# Altium schematic sheet 2_POWER.schdoc
size 309 x 223 mm; Symbol: Sheet-Symbol_A4; Device: Sheet-Symbol_A4; Company: 嘉立创EDA; Version: V1.0; Page Size: A4; @Project Name: STM32F407保险方案; @Page Count: 2; @Update Date: 2024-10-12; @Create Date: 2024-10-12; @Schematic Name: Schematic1_2; @Page No: 2; @Page Name: POWER; @Board Name: Board1_v1_修改; @Create Time: 12:06:10; @Update Time: 15:22:18
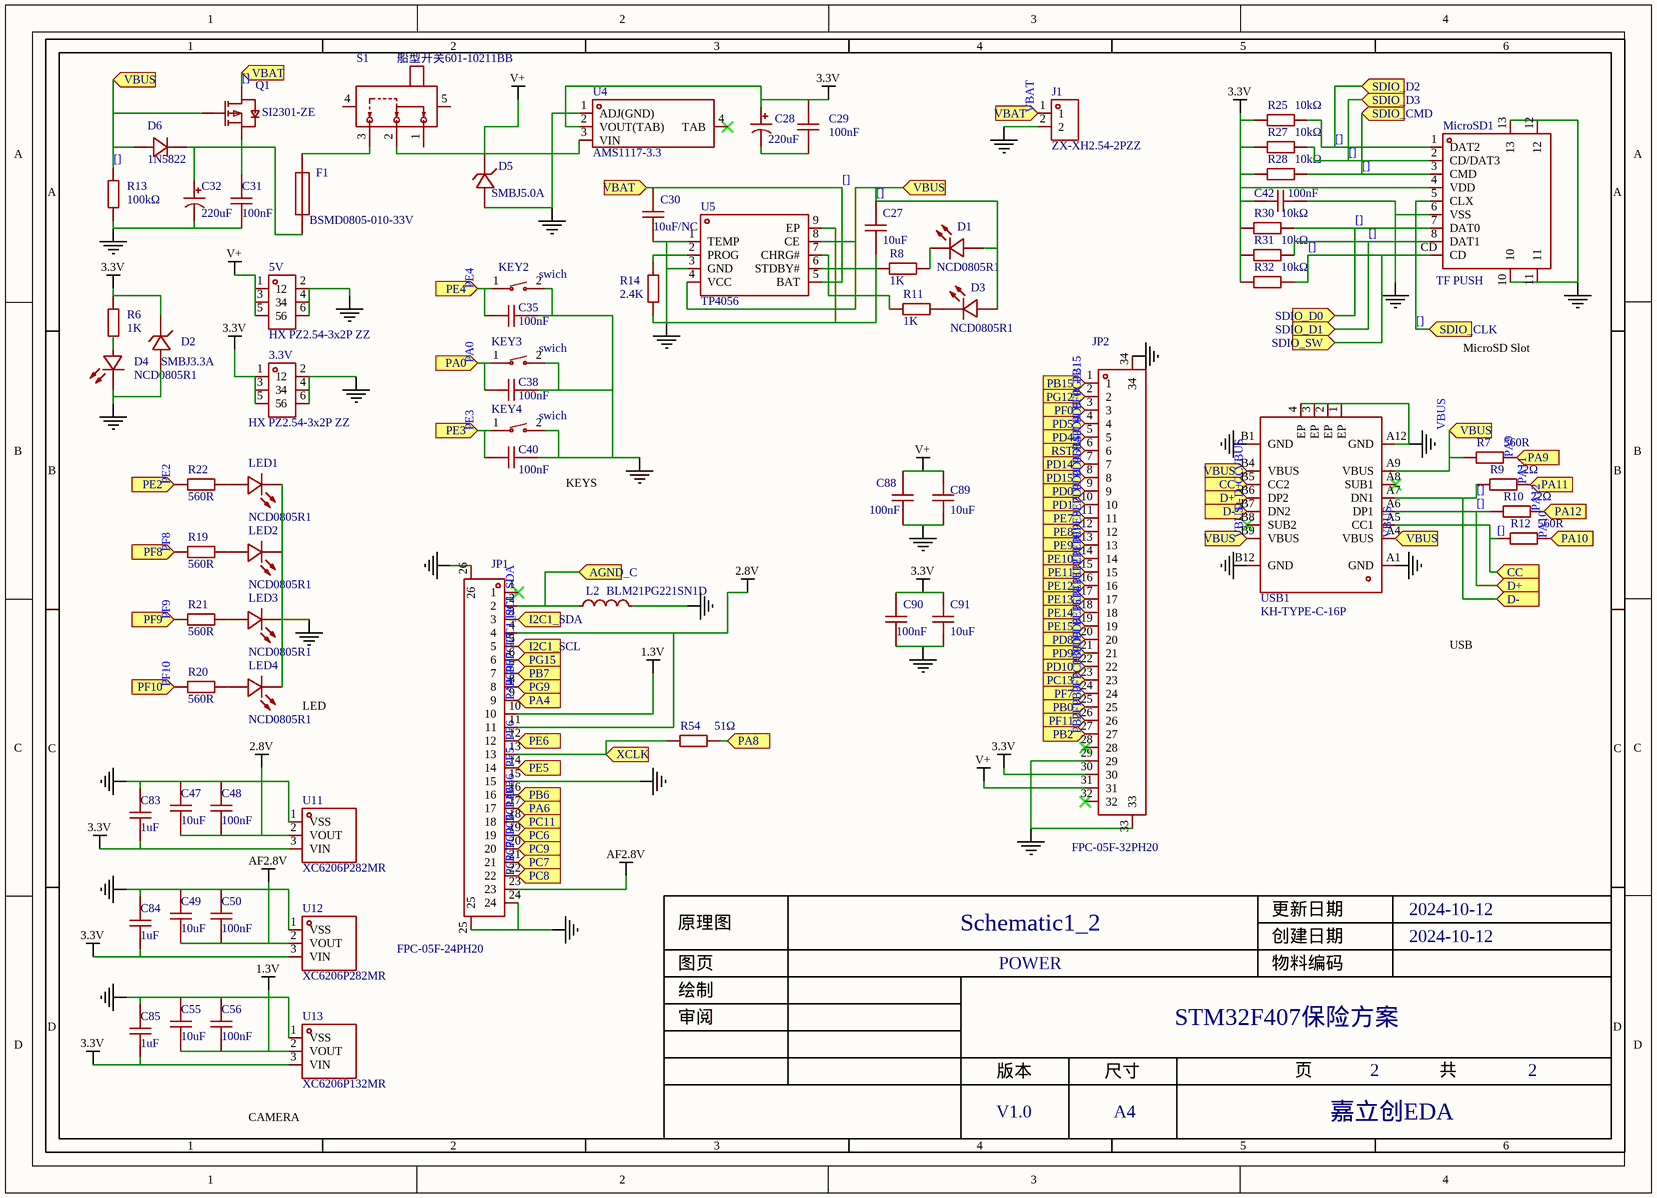
[diagram p0: 2_POWER.schdoc]

## Parts
3.3V  HX PZ2.54-3x2P ZZ  [HDR-TH_6P-P2.54-V-M-R3-C2-S2.54_2]  (value not drawn)
5V  HX PZ2.54-3x2P ZZ  [HDR-TH_6P-P2.54-V-M-R3-C2-S2.54_2]  (value not drawn)
C27  10uF  [C0805]  (value not drawn)
C28  220uF  [CAP-TH_BD8.0-P3.50-D0.6-FD]  (value not drawn)
C29  100nF  [C0805]  (value not drawn)
C30  10uF/NC  [C0805]  (value not drawn)
C31  100nF  [C0805]  (value not drawn)
C32  220uF  [CAP-TH_BD8.0-P3.50-D0.6-FD]  (value not drawn)
C35  100nF  [C0805]  (value not drawn)
C38  100nF  [C0805]  (value not drawn)
C40  100nF  [C0805]  (value not drawn)
C42  100nF  [C0805]  (value not drawn)
C47  10uF  [C0805]  (value not drawn)
C48  100nF  [C0805]  (value not drawn)
C49  10uF  [C0805]  (value not drawn)
C50  100nF  [C0805]  (value not drawn)
C55  10uF  [C0805]  (value not drawn)
C56  100nF  [C0805]  (value not drawn)
C83  1uF  [C0805]  (value not drawn)
C84  1uF  [C0805]  (value not drawn)
C85  1uF  [C0805]  (value not drawn)
C88  100nF  [C0805]  (value not drawn)
C89  10uF  [C0805]  (value not drawn)
C90  100nF  [C0805]  (value not drawn)
C91  10uF  [C0805]  (value not drawn)
D1  NCD0805R1  [LED0805-R-RD]  (value not drawn)
D2  SMBJ3.3A  [SMB_L4.6-W3.6-LS5.3-RD]  (value not drawn)
D3  NCD0805R1  [LED0805-R-RD]  (value not drawn)
D4  NCD0805R1  [LED0805-R-RD]  (value not drawn)
D5  SMBJ5.0A  [SMB_L4.4-W3.6-LS5.3-RD]  (value not drawn)
D6  1N5822  [SMA_1N4007]  (value not drawn)
F1  BSMD0805-010-33V  [F0805]  (value not drawn)
J1  ZX-XH2.54-2PZZ  [CONN-TH_2P-P2.50_HX25003-2A]  (value not drawn)
JP1  FPC-05F-24PH20  [FPC-SMD_24P-P0.50_FPC-05F-24PH20]  (value not drawn)
JP2  FPC-05F-32PH20  [FPC-SMD_32P-P0.50_XUNPU_FPC-05F-32PH20]  (value not drawn)
KEY2  swich  [KEY-SMD_L6.0-W3.6-LS8.0]  (value not drawn)
KEY3  swich  [KEY-SMD_L6.0-W3.6-LS8.0]  (value not drawn)
KEY4  swich  [KEY-SMD_L6.0-W3.6-LS8.0]  (value not drawn)
L2  BLM21PG221SN1D  [L0805]  (value not drawn)
LED1  NCD0805R1  [LED0805-R-RD]  (value not drawn)
LED2  NCD0805R1  [LED0805-R-RD]  (value not drawn)
LED3  NCD0805R1  [LED0805-R-RD]  (value not drawn)
LED4  NCD0805R1  [LED0805-R-RD]  (value not drawn)
MicroSD1  TF PUSH  [TF-SMD_TF-PUSH]  (value not drawn)
Q1  SI2301-ZE  [SOT-23-3_L2.9-W1.3-P1.90-LS2.4-BR]  (value not drawn)
R6  1K  [R0805]  (value not drawn)
R7  560R  [R0805]  (value not drawn)
R8  1K  [R0805]  (value not drawn)
R9  22Ω  [R0805]  (value not drawn)
R10  22Ω  [R0805]  (value not drawn)
R11  1K  [R0805]  (value not drawn)
R12  560R  [R0805]  (value not drawn)
R13  100kΩ  [R0805]  (value not drawn)
R14  2.4K  [R0805]  (value not drawn)
R19  560R  [R0805]  (value not drawn)
R20  560R  [R0805]  (value not drawn)
R21  560R  [R0805]  (value not drawn)
R22  560R  [R0805]  (value not drawn)
R25  10kΩ  [R0805]  (value not drawn)
R27  10kΩ  [R0805]  (value not drawn)
R28  10kΩ  [R0805]  (value not drawn)
R30  10kΩ  [R0805]  (value not drawn)
R31  10kΩ  [R0805]  (value not drawn)
R32  10kΩ  [R0805]  (value not drawn)
R54  51Ω  [R0805]  (value not drawn)
S1  船型开关601-10211BB  [ss-12f23-g4]  (value not drawn)
U4  AMS1117-3.3  [SOT-223-4_L6.5-W3.5-P2.30-LS7.0-BR]  (value not drawn)
U5  TP4056  [ESOP-8_L4.9-W3.9-P1.27-LS6.0-BL-EP]  (value not drawn)
U11  XC6206P282MR  [SOT-23-3_L2.9-W1.3-P1.90-LS2.4-BR]  (value not drawn)
U12  XC6206P282MR  [SOT-23-3_L2.9-W1.3-P1.90-LS2.4-BR]  (value not drawn)
U13  XC6206P132MR  [SOT-23-3_L2.9-W1.6-P1.90-LS2.8-BR]  (value not drawn)
USB1  KH-TYPE-C-16P  [usb-c-smd_kh-type-c-16p]  (value not drawn)

## Ports
AGND_C (in), CC (in), D+ (in), D- (in), I2C1_SCL (in), I2C1_SDA (in), PA0 (in), PA4 (in), PA6 (in), PA8 (in), PA9 (in), PA10 (in), PA11 (in), PA12 (in), PB0 (in), PB2 (in), PB6 (in), PB7 (in), PB15 (in), PC6 (in), PC7 (in), PC8 (in), PC9 (in), PC11 (in), PC13 (in), PD0 (in), PD1 (in), PD4 (in), PD5 (in), PD8 (in), PD9 (in), PD10 (in), PD14 (in), PD15 (in), PE2 (in), PE3 (in), PE4 (in), PE5 (in), PE6 (in), PE7 (in), PE8 (in), PE9 (in), PE10 (in), PE11 (in), PE12 (in), PE13 (in), PE14 (in), PE15 (in), PF0 (in), PF7 (in), PF8 (in), PF9 (in), PF10 (in), PF11 (in), PG9 (in), PG12 (in), PG15 (in), RST (in), SDIO_CLK (in), SDIO_CMD (in), SDIO_D0 (in), SDIO_D1 (in), SDIO_D2 (in), SDIO_D3 (in), SDIO_SW (in), VBAT (in), VBUS (in), XCLK (in)

## Nets
1.3V: C55.2 C56.2 JP1.10 U13.2(VOUT)
2.8V: C47.2 C48.2 JP1.4 JP1.11 U11.2(VOUT)
3.3V: 3.3V.1 3.3V.3 3.3V.5 C28.1 C29.2 C42.1 C83.1 C84.1 C85.1 C90.1 C91.1 D2.1(C) JP2.30 MicroSD1.4(VDD) R6.2 R25.1 R27.1 R28.1 R30.1 R31.1 R32.1 U4.2(VOUT(TAB)) U11.3(VIN) U12.3(VIN) U13.3(VIN)
AF2.8V: C49.2 C50.2 JP1.23 U12.2(VOUT)
GND: 3.3V.2 3.3V.4 3.3V.6 5V.2 5V.4 5V.6 C27.2 C30.1 C31.1 C32.2 C35.1 C38.1 C40.1 C42.2 C47.1 C48.1 C49.1 C50.1 C55.1 C56.1 C83.2 C84.2 C85.2 C88.2 C89.2 C90.2 C91.2 D2.2(A) D4.2(-) D5.2(A) J1.2 JP1.15 JP1.24 JP1.25 JP1.26 JP2.29 JP2.33 JP2.34 KEY2.2 KEY3.2 KEY4.2 L2.2 LED1.2(-) LED2.2(-) LED3.2(-) LED4.2(-) MicroSD1.6(VSS) MicroSD1.10 MicroSD1.11 MicroSD1.12 MicroSD1.13 R8.2 R13.1 R14.1 U4.1(ADJ(GND)) U5.1(TEMP) U5.3(GND) U5.6(STDBY#) U5.9(EP) U11.1(VSS) U12.1(VSS) U13.1(VSS) USB1.1(EP) USB1.2(EP) USB1.3(EP) USB1.4(EP) USB1.A1(GND) USB1.A12(GND) USB1.B1(GND) USB1.B12(GND)
V+: 5V.1 5V.3 5V.5 C88.1 C89.1 D5.1(C) JP2.31 S1.2 U4.3(VIN)
[]: C27.1 C30.2 D1.1(+) D3.1(+) D6.2(A) J1.1 MicroSD1.1(DAT2) MicroSD1.2(CD/DAT3) MicroSD1.3(CMD) MicroSD1.5(CLX) MicroSD1.7(DAT0) MicroSD1.8(DAT1) MicroSD1.CD Q1.1(G) Q1.3(D) R7.1 R9.1 R10.1 R12.1 R13.2 R25.2 R27.2 R28.2 R30.2 R31.2 R32.2 U5.4(VCC) U5.5(BAT) U5.8(CE) USB1.A4(VBUS) USB1.A5(CC1) USB1.A6(DP1) USB1.A7(DN1) USB1.A9(VBUS) USB1.B4(VBUS) USB1.B5(CC2) USB1.B6(DP2) USB1.B7(DN2) USB1.B9(VBUS) ; port SDIO_CLK, port SDIO_D0, port SDIO_D1, port SDIO_SW, port SDIO_CMD, port SDIO_D3, port SDIO_D2, port VBUS, port CC, port D+, port D-, port VBAT  [also labelled CC, D+, D-, VBAT, VBUS]
AGND_C: JP1.2 L2.1 ; port AGND_C
I2C1_SCL: JP1.5 ; port I2C1_SCL
I2C1_SDA: JP1.3 ; port I2C1_SDA
PA0: C38.2 KEY3.1 ; port PA0
PA4: JP1.9 ; port PA4
PA6: JP1.17 ; port PA6
PA8: R54.1 ; port PA8
PA9: R7.2 ; port PA9
PA10: R12.2 ; port PA10
PA11: R9.2 ; port PA11
PA12: R10.2 ; port PA12
PB0: JP2.25 ; port PB0
PB2: JP2.27 ; port PB2
PB6: JP1.16 ; port PB6
PB7: JP1.7 ; port PB7
PB15: JP2.1 ; port PB15
PC6: JP1.19 ; port PC6
PC7: JP1.21 ; port PC7
PC8: JP1.22 ; port PC8
PC9: JP1.20 ; port PC9
PC11: JP1.18 ; port PC11
PC13: JP2.23 ; port PC13
PD0: JP2.9 ; port PD0
PD1: JP2.10 ; port PD1
PD4: JP2.5 ; port PD4
PD5: JP2.4 ; port PD5
PD8: JP2.20 ; port PD8
PD9: JP2.21 ; port PD9
PD10: JP2.22 ; port PD10
PD14: JP2.7 ; port PD14
PD15: JP2.8 ; port PD15
PE2: R22.2 ; port PE2
PE3: C40.2 KEY4.1 ; port PE3
PE4: C35.2 KEY2.1 ; port PE4
PE5: JP1.14 ; port PE5
PE6: JP1.12 ; port PE6
PE7: JP2.11 ; port PE7
PE8: JP2.12 ; port PE8
PE9: JP2.13 ; port PE9
PE10: JP2.14 ; port PE10
PE11: JP2.15 ; port PE11
PE12: JP2.16 ; port PE12
PE13: JP2.17 ; port PE13
PE14: JP2.18 ; port PE14
PE15: JP2.19 ; port PE15
PF0: JP2.3 ; port PF0
PF7: JP2.24 ; port PF7
PF8: R19.2 ; port PF8
PF9: R21.2 ; port PF9
PF10: R20.2 ; port PF10
PF11: JP2.26 ; port PF11
PG9: JP1.8 ; port PG9
PG12: JP2.2 ; port PG12
PG15: JP1.6 ; port PG15
RST: JP2.6 ; port RST
XCLK: JP1.13 R54.2 ; port XCLK
NetC28_2: C28.2 C29.1
NetC31_2: C31.2 C32.1 D6.1(K) F1.1 Q1.2(S)
NetD1_2: D1.2(-) R8.1
NetD3_2: D3.2(-) R11.1
NetD4_1: D4.1(+) R6.1
NetF1_2: F1.2 S1.3
NetLED1_1: LED1.1(+) R22.1
NetLED2_1: LED2.1(+) R19.1
NetLED3_1: LED3.1(+) R21.1
NetLED4_1: LED4.1(+) R20.1
NetR11_2: R11.2 U5.7(CHRG#)
NetR14_2: R14.2 U5.2(PROG)

Not connected (* = marked no-connect by the designer): JP1 1*; JP2 28* 32*; S1 1 4 5; U4 4(TAB)*; USB1 A8(SUB1)* B8(SUB2)*

## Notes on the sheet
- MicroSD Slot
- KEYS
- USB
- (near LED4) LED
- CAMERA
- 1
- 2
- 3
- 4
- 5
- 6
- A
- B
- C
- 原理图
- Schematic1_2
- 创建日期
- 更新日期
- 2024-10-12
- 审阅
- 绘制
- 图页
- POWER
- 物料编码
- STM32F407保险方案
- D
- 版本
- 尺寸
- 页
- 共
- V1.0
- A4
- 嘉立创EDA

## Library data of the parts
3.3V 5V = HX PZ2.54-3x2P ZZ: 插针结构:3x2P;间距:2.54mm;行距:-;圆针/方针:方针;安装类型:直插;排数:三排;总PIN位数:6P;额定电流:3A;额定电压:1kV;配合针长度:3mm;塑高:2.5mm;端接针长度:6mm;触头材质:黄铜;触头镀层:金;工作温度范围:-40℃~+105℃;焊接温度(最大值):260℃;; Manufacturer: hanxia(韩下); Add into BOM: yes; Pin Structure: 3x2P; Pitch: 2.54mm; Circluar Pins/Square Pins: 方针; Current Rating (Max): 3A; Voltage Rating (Max): 1kV; Soldering Temperature(Max): 260℃; Symbol: HX PZ2.54-3X2P ZZ; Device: HX PZ2.54-3x2P ZZ; LCSC Part Name: 3x2P 间距:2.54mm 方针 直插; Supplier Part: C32713289; Manufacturer Part: HX PZ2.54-3x2P ZZ; Supplier Footprint: 插件,P=2.54mm; JLCPCB Part Class: Extended Part; Datasheet: https://atta.szlcsc.com/upload/public/pdf/source/20240723/4E1FACE653747A809B5D75F488A270D9.pdf; Supplier: LCSC; Convert to PCB: yes; Row Spacing: -; Mounting Type: 直插; Number of Rows: 三排; Number of Pins: 6P; Length of Mating Pin: 3mm; Insulation Height: 2.5mm; Length of End Connection Pin: 6mm; Contact Material: 黄铜; Contact Plating: 金; Operating Temperature Range: -40℃~+105℃
C27 C30 C47 C49 C55 = CL21A106KAYNNNE_C15850: 容值:10uF;精度:±10%;额定电压:25V;材质(温度系数):X5R;; Manufacturer: SAMSUNG(三星); Symbol: CapAcitance; Add into BOM: yes; Tolerance: ±10%; Voltage Rated: 25V; Temperature Coefficient: X5R; Device: CL21A106KAYNNNE_C15850; LCSC Part Name: 10uF ±10% 25V; Supplier Part: C15850; Manufacturer Part: CL21A106KAYNNNE; Supplier Footprint: 0805; JLCPCB Part Class: Basic Part; Datasheet: https://atta.szlcsc.com/upload/public/pdf/source/20160218/1457707763339.pdf; Supplier: LCSC; Convert to PCB: yes
  C27 C47 C49 C55: Value: 10uF
  C30: Value: 10uF/NC
C28 C32 = ERE1VM221F12OT: 容值:220uF;精度:±20%;额定电压:35V;纹波电流:-;等效串联电阻:-;; Manufacturer: AISHI(艾华集团); Add into BOM: yes; Tolerance: ±20%; Rated Voltage: 35V; φD: 8mm; L: 12mm; Lifetime @ Temp: 3000hrs@105℃; Symbol: ERE1VM221F12OT; Device: ERE1VM221F12OT; LCSC Part Name: 220uF ±20% 35V; Supplier Part: C106510; Manufacturer Part: ERE1VM221F12OT; Supplier Footprint: 插件,D8xL12mm; Datasheet: https://atta.szlcsc.com/upload/public/pdf/source/20190702/C401559_D116D2C5ED42D458EC9986A0749FDD04.pdf; Supplier: LCSC; Convert to PCB: yes; Value: 220uF; Ripple Current: -; Equivalent Series Resistance(ESR): -; Lead Spacing: 3.5mm
C29 C31 C35 C38 C40 C42 C48 C50 C56 C88-C91 = CC0805KRX7R9BB104: 容值:100nF;精度:±10%;额定电压:50V;材质(温度系数):X7R;; Manufacturer: YAGEO(国巨); Symbol: CapAcitance; Add into BOM: yes; Tolerance: ±10%; Voltage Rated: 50V; Temperature Coefficient: X7R; Device: CC0805KRX7R9BB104; LCSC Part Name: 100nF ±10% 50V; Supplier Part: C49678; Manufacturer Part: CC0805KRX7R9BB104; Supplier Footprint: 0805; JLCPCB Part Class: Basic Part; Datasheet: https://atta.szlcsc.com/upload/public/pdf/source/20180224/C181747_15194369449651363981.pdf; Supplier: LCSC; Convert to PCB: yes
  C29 C31 C35 C38 C40 C42 C48 C50 C56 C88 C90: Value: 100nF
  C89 C91: Value: 10uF
C83-C85 = CL21B105KBFNNNE: 容值:1uF;精度:±10%;额定电压:50V;材质(温度系数):X7R;; Manufacturer: SAMSUNG(三星); Symbol: CapAcitance; Add into BOM: yes; Tolerance: ±10%; Voltage Rated: 50V; Temperature Coefficient: X7R; Device: CL21B105KBFNNNE; LCSC Part Name: 1uF ±10% 50V; Supplier Part: C28323; Manufacturer Part: CL21B105KBFNNNE; Supplier Footprint: 0805; JLCPCB Part Class: Basic Part; Datasheet: https://atta.szlcsc.com/upload/public/pdf/source/20160218/1457707763339.pdf; Supplier: LCSC; Convert to PCB: yes; Value: 1uF
D1 D3 D4 LED1-LED4 = NCD0805R1: 灯头类型:-;发光颜色:红色;正向电压(VF):1.6V~2.6V;功率:65mW;正向电流:20mA;主波长:615nm~630nm;二极管配置:独立二极管;透镜颜色:无色透明透镜;色温:-;发光强度:67mcd~195mcd;发光角度:130°;载带方式:-;工作温度:-30℃~+85℃;; Manufacturer: 国星光电; Symbol: FC-2012HRK-620D; Add into BOM: yes; Emitted Color: 红色; Power Dissipation: 65mW; Forward Current: 20mA; Diode Configuration: 独立二极管; Lens Color: 无色透明透镜; Viewing Angle: 130°; Device: NCD0805R1; LCSC Part Name: NCD0805R1; Supplier Part: C84256; Manufacturer Part: NCD0805R1; Supplier Footprint: 0805; JLCPCB Part Class: Basic Part; Datasheet: https://atta.szlcsc.com/upload/public/pdf/source/20200820/C84256_F0A75A43B3EAD75808600A0514C76B99.pdf; Supplier: LCSC; Convert to PCB: yes; Lamp Holder Type: -; Forward Voltage (VF): 1.6V~2.6V; Dominant Wavelength: 615nm~630nm; Peak Wavelength: -; Color Temperature: -; Luminous Intensity: 67mcd~195mcd; Mounting Sytle: -; Operating Temperature: -30℃~+85℃
D2 = SMBJ3.3A_C5439946: 极性:单向;反向截止电压(Vrwm):3.3V;最大钳位电压:7.3V@50A;峰值脉冲电流(Ipp)@10/1000us:50A;峰值脉冲功率(Ppp)@10/1000us:600W;击穿电压:4.15V;; Manufacturer: BORN(伯恩半导体); Add into BOM: yes; polarity: 单向; Reverse Stand-Off Voltage (Vrwm): 3.3V; Peak Pulse Current (Ipp)@10/1000us: 50A; Peak Pulse Power Dissipation (Ppp)@10/1000us: 600W; Breakdown Voltage: 4.15V; Reverse Leakage Current (Ir): 20nA; Type: TVS; Symbol: SMBJ3.3A_C5439946; Device: SMBJ3.3A_C5439946; LCSC Part Name: SMBJ3.3A; Supplier Part: C5439946; Manufacturer Part: SMBJ3.3A; Supplier Footprint: SMB; Datasheet: https://atta.szlcsc.com/upload/public/pdf/source/20230330/9A53EFF917634FE797D84BEC1725CE7E.pdf; Supplier: LCSC; Convert to PCB: yes; Maximum Clamping Voltage: 7.3V@50A
D5 = SMBJ5.0A_C726811: 极性：单向 反向截止电压(Vrwm)：5V 击穿电压：6.4V 最大钳位电压：9.2V; Manufacturer: TWGMC(台湾迪嘉); Add into BOM: yes; Symbol: SMBJ5.0A_C726811; Device: SMBJ5.0A_C726811; Supplier: LCSC; Supplier Part: C726811; Manufacturer Part: SMBJ5.0A; LCSC Part Name: SMBJ5.0A; Supplier Footprint: SMB; Datasheet: https://atta.szlcsc.com/upload/public/pdf/source/20200901/C726811_07201DC3516E92FF13903A0BAE18F725.pdf; Convert to PCB: yes
D6 = D_1N4007: 正向压降(Vf):600mV@1A;直流反向耐压(Vr):40V;平均整流电流(Io):1A;; Manufacturer: Hottech(合科泰); Add into BOM: yes; Reverse Voltage (Vr): 40V; Rectified Current: 3A; Reverse Leakage Current (Ir): 500uA@40V; Average Rectified Current (Io): 1A; Symbol: D_1N4007; Device: D_1N4007; Convert to PCB: yes; Supplier Footprint: SMA; LCSC Part Name: 电压:40V 电流:1A; Supplier Part: C191023; Manufacturer Part: 1N5822; JLCPCB Part Class: Basic Part; Datasheet: https://atta.szlcsc.com/upload/public/pdf/source/20220428/3CB86FD8D28D653594B4E35F9D5AEFD9.pdf; Supplier: LCSC; Forward Voltage (Vf@If): 600mV@1A
F1 = BSMD0805-010-33V: 最大电压:33V;最大电流:40A;保持电流:100mA;跳闸电流:300mA;; Manufacturer: BHFUSE(佰宏); Add into BOM: yes; Operating Voltage (Max): 33V; Current Rating (Max): 40A; Hold Current: 100mA; Trip Current: 300mA; Power Dissipation: 500mW; Resistance - Initial (Ri) (Min): 750mΩ; Resistance - Post Trip (R1) (Max): 6Ω; Maximum Time to Trip: 1.5s; Symbol: BSMD0805-010-33V; Device: BSMD0805-010-33V; Supplier: LCSC; Supplier Part: C883101; Manufacturer Part: BSMD0805-010-33V; JLCPCB Part Class: Extended Part; LCSC Part Name: 0805 0.1A 33V 国产高电压; Supplier Footprint: 0805; Datasheet: https://atta.szlcsc.com/upload/public/pdf/source/20230512/7A46D6CD923C15CBB98FD769C08EDD80.pdf; Convert to PCB: yes; Operating Temperature: -40℃~+85℃
J1 = ZX-XH2.54-2PZZ: 插针结构:1x2P;间距:2.54mm;安装方式:直插;参考系列:XH;总PIN数:2P;排数:1;每排PIN数:2;行距:-;额定电流:3A;触头材质:黄铜;触头镀层:锡;工作温度范围:-25℃~+85℃;; Manufacturer: Megastar(兆星); Add into BOM: yes; Pins Structure: 1x2P; Pitch: 2.54mm; Reference Series: XH; Number of PINs Per Row: 2; Current Rating (Max): 3A; Symbol: ZX-XH2.54-2PZZ; Device: ZX-XH2.54-2PZZ; LCSC Part Name: ZX-XH2.54-2PZZ; Supplier Part: C7429632; Manufacturer Part: ZX-XH2.54-2PZZ; Supplier Footprint: 插件,P=2.54mm; JLCPCB Part Class: Extended Part; Datasheet: https://atta.szlcsc.com/upload/public/pdf/source/20230619/19BA6947230AA44A04D3EDD65E618FD0.pdf; Supplier: LCSC; Convert to PCB: yes; Mounting Style: 直插; Number of Pins: 2P; Number of Rows: 1; Row Spacing: -; Contact Material: 黄铜; Contact Plating: 锡; Operating Temperature Range: -25℃~+85℃
JP1 = FPC-05F-24PH20: 锁定特性:翻盖式;触点类型:下接;触点数量:24P;间距:0.5mm;安装类型:卧贴;工作温度范围:-25℃~+85℃;; Manufacturer: XUNPU(讯普); Add into BOM: yes; Locking Feature: 翻盖式; Number of Contacts: 24P; Pitch: 0.5mm; FFC, FCB Thickness: 0.3mm; Symbol: FPC-05F-24PH20; Device: FPC-05F-24PH20; Supplier: LCSC; Supplier Part: C2856805; Manufacturer Part: FPC-05F-24PH20; JLCPCB Part Class: Extended Part; LCSC Part Name: 间距:0.5mm P数:24P 翻盖式 下接; Supplier Footprint: SMD,P=0.5mm,卧贴; Datasheet: https://atta.szlcsc.com/upload/public/pdf/source/20210922/C2856805_8542C20E2D7FF0FC4EEBD919AE0F6905.pdf; Convert to PCB: yes; Contact Type: 下接; Mounting Type: 卧贴; Height Above Board: 2mm; Operating Temperature Range: -25℃~+85℃
JP2 = FPC-05F-32PH20: 锁定特性:翻盖式;触点类型:下接;触点数量:32P;间距:0.5mm;安装类型:卧贴;工作温度范围:-25℃~+85℃;; Manufacturer: XUNPU(讯普); Add into BOM: yes; Locking Feature: 翻盖式; Number of Contacts: 32P; Pitch: 0.5mm; FFC, FCB Thickness: 0.3mm; Symbol: FPC-05F-32PH20; Device: FPC-05F-32PH20; Supplier: LCSC; Supplier Part: C2856809; Manufacturer Part: FPC-05F-32PH20; LCSC Part Name: 间距:0.5mm P数:32P 翻盖式 下接; Supplier Footprint: SMD,P=0.5mm,卧贴; Datasheet: https://atta.szlcsc.com/upload/public/pdf/source/20210922/C2856809_56CF9CFE6EC87387262B112CEC8BB4AE.pdf; Convert to PCB: yes; Contact Type: 下接; Mounting Type: 卧贴; Height Above Board: 2mm; Operating Temperature Range: -25℃~+85℃
KEY2-KEY4 = UK-B0240-R-250-JZ: 电路结构:单刀单掷;按钮形状:矩形按钮;作用力:250gf;安装方式:立贴;开关长度:6mm;开关宽度:3.6mm;开关高度:2.5mm;带支架:不带;触点电流:50mA;额定电压(DC):12V;绝缘电阻:100MΩ;带灯:无;机械寿命:10万次;; Manufacturer: USAKRO(美韩); Add into BOM: yes; Circuit: 单刀单掷; Actuator Style: 矩形按钮; Operating Force: 250gf; Switch Length: 6mm; Switch Width: 3.6mm; Switch Height: 2.5mm; Strike Gundam: 不带; Contact Current: 50mA; Voltage Rating (DC): 12V; Insulation Resistance: 100MΩ; Actuator/Cap Color: 红色; With Lamp: 无; Pin Style: 鸥翼型; Mechanical Life: 10万次; Symbol: UK-B0240-R-250-JZ; Device: UK-B0240-R-250-JZ; Supplier: LCSC; Supplier Part: C698192; Manufacturer Part: swich; JLCPCB Part Class: Extended Part; LCSC Part Name: 6*3.6*2.5mm 立贴 轻触开关; Supplier Footprint: SMD; Datasheet: https://atta.szlcsc.com/upload/public/pdf/source/20200708/C698192_4C83FD1DB5EA5644F9F247945444D54B.pdf; Convert to PCB: yes; Mounting Style: 立贴; Operating Temperature: -20℃~+70℃; Voltage Rating (AC): -; Power Rating: -; IP Rating: -
L2 = BLM21PG221SN1D: 标称阻抗@测试频率:220Ω@100MHz;误差:±25%;直流电阻(RDC):45mΩ;; Manufacturer: muRata(村田); Add into BOM: yes; Tolerance: ±25%; DC Resistance: 45mΩ; Current Rating: 2A; Circuits: 1; Symbol: BLM21PG221SN1D; Device: BLM21PG221SN1D; LCSC Part Name: 单路 0805磁珠 阻抗220Ω@100MHz; Supplier Part: C85840; Manufacturer Part: BLM21PG221SN1D; Supplier Footprint: 0805; JLCPCB Part Class: Extended Part; Datasheet: https://atta.szlcsc.com/upload/public/pdf/source/20180326/C118443_3FAC30E9A4F0E6B81275543C61E0685E.pdf; Supplier: LCSC; Convert to PCB: yes; Impedance @ Frequency: 220Ω@100MHz
MicroSD1 = TF PUSH: 卡连接方式:自弹式;卡类型:MicroSD卡(TF卡);连接器类型:卡座;本体最大高度:2mm;触头材质:-;触头镀层:-;工作温度范围:-20℃~+90℃;焊接温度(最大值):-;; Manufacturer: SHOU HAN(首韩); Add into BOM: yes; Card Connection Mode: 自弹式; Connector Type: 卡座; Maximum Body Height: 2mm; Additional Card Detection Pins: 无; Symbol: TF PUSH; Device: TF PUSH; LCSC Part Name: 自弹式 MicroSD卡(TF卡) 卡座; Supplier Part: C393941; Manufacturer Part: TF PUSH; Supplier Footprint: SMD; Datasheet: https://atta.szlcsc.com/upload/public/pdf/source/20191011/C393941_0DDD896EE907FEB750D8B7B8982E2A67.pdf; Supplier: LCSC; Convert to PCB: yes; Card Type: MicroSD卡(TF卡); Contact Material: -; Contact Plating: -; Operating Temperature Range: -20℃~+90℃; Soldering Temperature(Max): -; Supplementary Features: -
Q1 = SI2301-ZE: 类型:1个P沟道;漏源电压(Vdss):20V;连续漏极电流(Id):2.3A;功率(Pd):700mW;导通电阻(RDS(on)@Vgs,Id):126mΩ@4.5V;阈值电压(Vgs(th)@Id):1V@250uA;; Manufacturer: HXY MOSFET(华轩阳电子); Add into BOM: yes; Type: 1个P沟道; Drain Source Voltage (Vdss): 20V; Continuous Drain Current (Id): 2.3A; Power Dissipation (Pd): 700mW; Input Capacitance (Ciss@Vds): 285pF; Symbol: SI2301-ZE; Device: SI2301-ZE; LCSC Part Name: 1个P沟道 耐压:20V 电流:2.3A; Supplier Part: C5261052; Manufacturer Part: SI2301-ZE; Supplier Footprint: SOT-23; Datasheet: https://atta.szlcsc.com/upload/public/pdf/source/20230515/2FF2907841563ED329594D3237822724.pdf; Supplier: LCSC; Convert to PCB: yes; Drain Source On Resistance (RDS(on)@Vgs,Id): 126mΩ@4.5V; Gate Threshold Voltage (Vgs(th)@Id): 1V@250uA
R6-R8 R11 R12 R14 R19-R22 = Res_0603: Symbol: 电阻; Convert to PCB: yes; Device: Res_0603; Add into BOM: yes; Supplier Footprint: 0603
  R6 R8 R11: Value: 1K
  R7 R12 R19-R22: Value: 560R
  R14: Value: 2.4K
R9 R10 = 0805W8F220JT5E: 电阻类型:厚膜电阻;阻值:22Ω;精度:±1%;功率:125mW;最大工作电压:150V;温度系数:±100ppm/℃;; Manufacturer: UNI-ROYAL(厚声); Symbol: 电阻; Add into BOM: yes; Tolerance: ±1%; Power(Watts): 125mW; Overload Voltage (Max): 150V; Device: 0805W8F220JT5E; LCSC Part Name: 22Ω ±1% 125mW 厚膜电阻; Supplier Part: C17561; Manufacturer Part: 0805W8F220JT5E; Supplier Footprint: 0805; JLCPCB Part Class: Basic Part; Datasheet: https://atta.szlcsc.com/upload/public/pdf/source/20200306/C422600_1E6D84923E4A46A82E41ADD87F860B5C.pdf; Supplier: LCSC; Convert to PCB: yes; Type: 厚膜电阻; Value: 22Ω; Temperature Coefficient: ±100ppm/℃; Operating Temperature Range: -55℃~+155℃
R13 = 0805W8F1003T5E: 电阻类型:厚膜电阻;阻值:100kΩ;精度:±1%;功率:125mW;最大工作电压:150V;温度系数:±100ppm/℃;; Manufacturer: UNI-ROYAL(厚声); Symbol: 电阻; Add into BOM: yes; Tolerance: ±1%; Power(Watts): 125mW; Overload Voltage (Max): 150V; Device: 0805W8F1003T5E; LCSC Part Name: 100kΩ ±1% 125mW 厚膜电阻; Supplier Part: C149504; Manufacturer Part: 0805W8F1003T5E; Supplier Footprint: 0805; JLCPCB Part Class: Basic Part; Datasheet: https://atta.szlcsc.com/upload/public/pdf/source/20200306/C422600_1E6D84923E4A46A82E41ADD87F860B5C.pdf; Supplier: LCSC; Convert to PCB: yes; Type: 厚膜电阻; Value: 100kΩ; Temperature Coefficient: ±100ppm/℃; Operating Temperature Range: -55℃~+155℃
R25 R27 R28 R30-R32 = 0805W8F1002T5E_C17414: 电阻类型:厚膜电阻;阻值:10kΩ;精度:±1%;功率:125mW;最大工作电压:150V;温度系数:±100ppm/℃;; Manufacturer: UNI-ROYAL(厚声); Symbol: 电阻; Add into BOM: yes; Tolerance: ±1%; Power(Watts): 125mW; Overload Voltage (Max): 150V; Device: 0805W8F1002T5E_C17414; LCSC Part Name: 10kΩ ±1% 125mW 厚膜电阻; Supplier Part: C17414; Manufacturer Part: 0805W8F1002T5E; Supplier Footprint: 0805; JLCPCB Part Class: Basic Part; Datasheet: https://atta.szlcsc.com/upload/public/pdf/source/20200306/C422600_1E6D84923E4A46A82E41ADD87F860B5C.pdf; Supplier: LCSC; Convert to PCB: yes; Type: 厚膜电阻; Value: 10kΩ; Temperature Coefficient: ±100ppm/℃; Operating Temperature Range: -55℃~+155℃
R54 = 0805W8F510JT5E: 电阻类型:厚膜电阻;阻值:51Ω;精度:±1%;功率:125mW;最大工作电压:150V;温度系数:±100ppm/℃;; Manufacturer: UNI-ROYAL(厚声); Symbol: 电阻; Add into BOM: yes; Tolerance: ±1%; Power(Watts): 125mW; Overload Voltage (Max): 150V; Device: 0805W8F510JT5E; LCSC Part Name: 51Ω ±1% 125mW 厚膜电阻; Supplier Part: C17738; Manufacturer Part: 0805W8F510JT5E; Supplier Footprint: 0805; JLCPCB Part Class: Basic Part; Datasheet: https://atta.szlcsc.com/upload/public/pdf/source/20200306/C422600_1E6D84923E4A46A82E41ADD87F860B5C.pdf; Supplier: LCSC; Convert to PCB: yes; Type: 厚膜电阻; Value: 51Ω; Temperature Coefficient: ±100ppm/℃; Operating Temperature Range: -55℃~+155℃
S1 = 船型开关601-10211BB: Add into BOM: yes; Symbol: SS-12F23-G4; Device: 船型开关601-10211BB; LCSC Part Name: 船型开关601-10211BB; Supplier Part: C67849; Manufacturer Part: 船型开关601-10211BB; Supplier Footprint: 直脚 三脚两档; JLCPCB Part Class: 扩展库; Supplier: LCSC; Convert to PCB: yes
U4 = AMS1117-3.3_C347222: 输出类型:固定;最大输入电压:12V;输出电压:3.3V;最大输出电流:1A;电源纹波抑制比(PSRR):60dB@(120Hz);输出极性:正极;; Manufacturer: UMW(友台半导体); Add into BOM: yes; Output Type: 固定; Maximum Input Voltage: 12V; Output Voltage: 3.3V; MAX Output Current: 1A; Dropout Voltage: 1.3V@(1A); Output Polarity: 正极; Number of Outputs: 1; Symbol: AMS1117-3.3_C347222; Device: AMS1117-3.3_C347222; LCSC Part Name: 输出:3.3V 电流:1A 耐压:12V; Supplier Part: C347222; Manufacturer Part: AMS1117-3.3; Supplier Footprint: SOT-223; Datasheet: https://atta.szlcsc.com/upload/public/pdf/source/20231109/155D79A26D9DB04352555A58D5969DC8.pdf; Supplier: LCSC; Convert to PCB: yes; Power Supply Rejection Ratio (PSRR): 60dB@(120Hz); standby current: -; Noise: -; Feature: -; Operating Temperature: -
U5 = TP4056_C725790: Manufacturer: UMW(友台半导体); Add into BOM: yes; Symbol: TP4056_C725790; Device: TP4056_C725790; LCSC Part Name: TP4056; Supplier Part: C725790; Manufacturer Part: TP4056; Supplier Footprint: ESOP-8; JLCPCB Part Class: Extended Part; Datasheet: https://atta.szlcsc.com/upload/public/pdf/source/20231109/CF74897CE79A500F7FE27A45ADCCC631.pdf; Supplier: LCSC; Convert to PCB: yes
U11 U12 = XC6206P282MR: 输出类型:固定;最大输入电压:6V;输出电压:2.8V;最大输出电流:250mA;输出极性:正极;; Manufacturer: YONGYUTAI(永裕泰); Symbol: XC6206P282MR_C2934870; Add into BOM: yes; Output Type: 固定; Maximum Input Voltage: 6V; Output Voltage: 2.8V; MAX Output Current: 250mA; Output Polarity: 正极; Number of Outputs: 1; Device: XC6206P282MR; LCSC Part Name: 高精度，低功耗，高电压，正电压调整器; Supplier Part: C2934870; Manufacturer Part: XC6206P282MR; Supplier Footprint: SOT-23; Datasheet: https://atta.szlcsc.com/upload/public/pdf/source/20211028/7BAE2D9FEDA11A30305FD6FAB15CFEC6.pdf; Supplier: LCSC; Convert to PCB: yes; Operating Temperature: -40℃~+85℃@(Tj)
U13 = XC6206P132MR: 输出类型:固定;最大输入电压:7V;输出电压:1.3V;最大输出电流:60mA;电源纹波抑制比(PSRR):-;输出极性:正极;; Manufacturer: TOREX(特瑞仕); Add into BOM: yes; Output Type: 固定; Maximum Input Voltage: 7V; Output Voltage: 1.3V; MAX Output Current: 60mA; Dropout Voltage: 960mV@(60mA); Output Polarity: 正极; Number of Outputs: 1; Symbol: XC6206P132MR; Device: XC6206P132MR; Supplier: LCSC; Supplier Part: C424700; Manufacturer Part: XC6206P132MR; LCSC Part Name: 输入7V 输出1.3V 60mA; Supplier Footprint: SOT-23; Datasheet: https://atta.szlcsc.com/upload/public/pdf/source/20200117/C484266_EE638359EA530088949E891FD0EEEA32.pdf; Convert to PCB: yes; Power Supply Rejection Ratio (PSRR): -
USB1 = KH-TYPE-C-16P: 连接器类型:Type-C;标准:-;公母:母;端口数量:1;触点数量:16P;安装方式:卧贴;额定电流 - 电源:3A;工作温度范围:-40℃~+85℃;; Manufacturer: kinghelm(金航标); Add into BOM: yes; Connector Type: Type-C; Gender: 母; Number of Ports: 1; Number of Contacts: 16P; Current Rating - Power (Max): 3A; Symbol: KH-TYPE-C-16P; Device: KH-TYPE-C-16P; LCSC Part Name: Type-C 母 卧贴; Supplier Part: C709357; Manufacturer Part: KH-TYPE-C-16P; Supplier Footprint: SMD; Datasheet: https://atta.szlcsc.com/upload/public/pdf/source/20200911/C709357_AA8DCEB38BB20E3035A7ED7AE7667837.pdf; Supplier: LCSC; Convert to PCB: yes; Standard: -; Mounting Style: 卧贴; Operating Temperature Range: -40℃~+85℃